# EAGLE design telem_board (EAGLE 6.5.0)
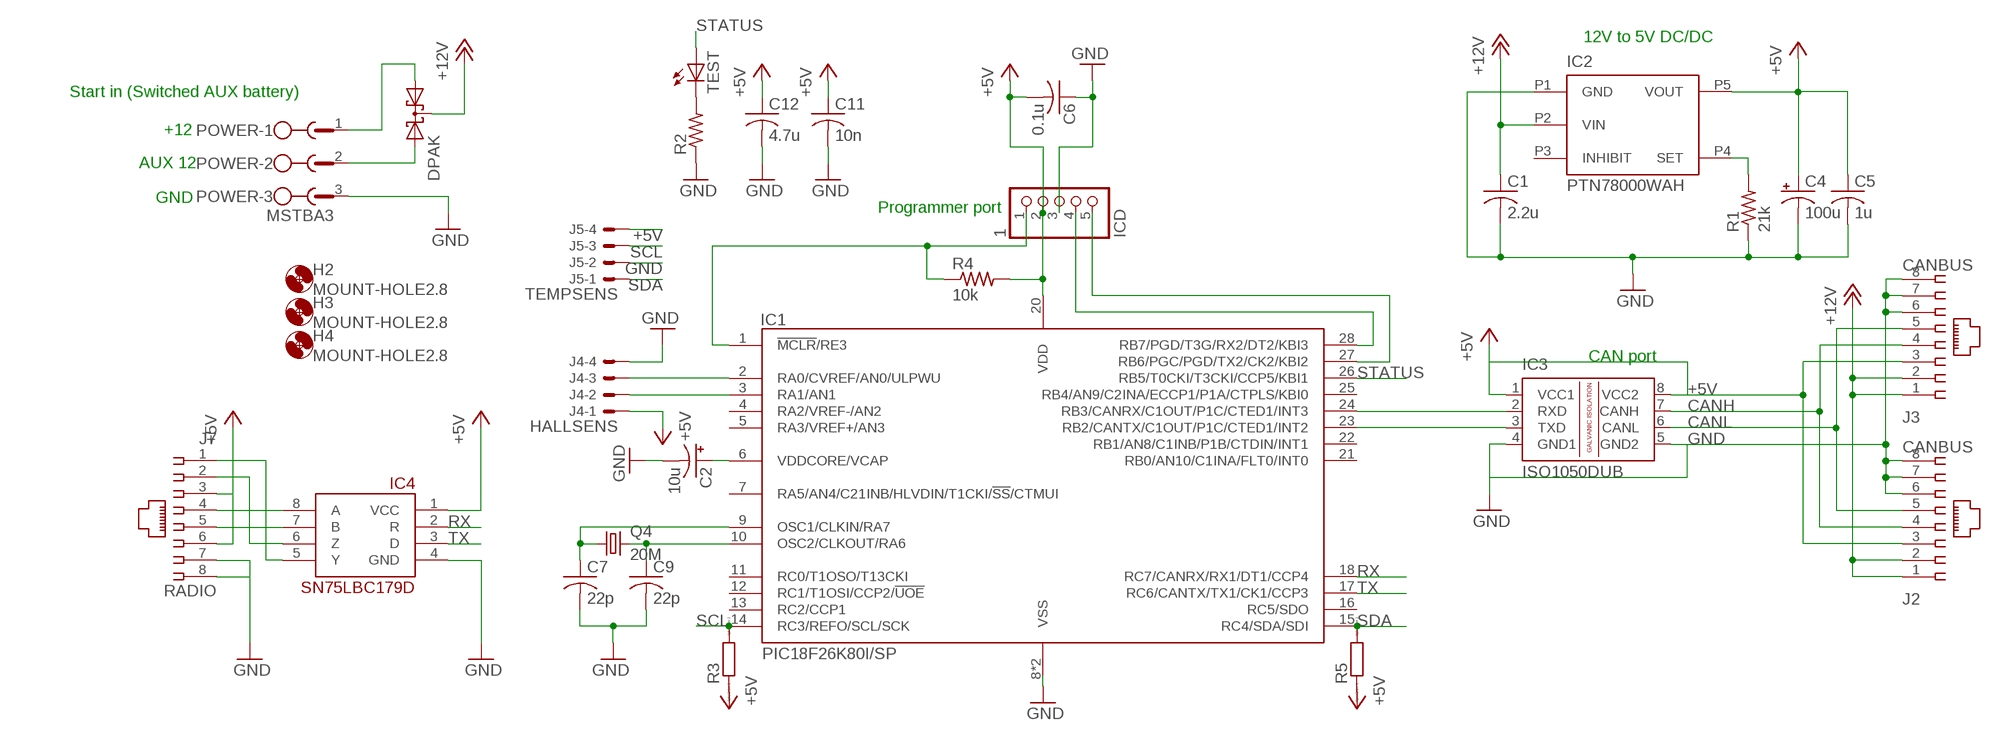
[diagram p0: schematic, sheet 1]

## Parts
1  ICD  PINHD-1X5  [1X05]
C1  2.2u  C-USC1206  [C1206]
C2  10u  CPOL-USTT2D4  [TT2D4]
C4  100u  CPOL-USSMCD  [SMC_D]
C5  1u  C-USC0805  [C0805]
C6  0.1u  C-USC0805  [C0805]
C7  22p  C-USC0805  [C0805]
C9  22p  C-USC0805  [C0805]
C11  10n  C-USC0805  [C0805]
C12  4.7u  C-USC0805  [C0805]
DPAK  DIODE_2SCHOTTKY-DPAK  [DPAK]
H2  MOUNT-HOLE2.8  [2,8]
H3  MOUNT-HOLE2.8  [2,8]
H4  MOUNT-HOLE2.8  [2,8]
IC1  PIC18F26K80I/SP  [DIL28/3]
IC2  PTN78000WAH  [PTN78000]
IC3  ISO1050DUB  [DUB-R-PDSO-G8]
IC4  SN75LBC179D  [SO08]
J2  CANBUS  215877-7  [215877-7]
J3  CANBUS  215877-7  [215877-7]
J4  HALLSENS  22-27-2041-04  [6410-04]
J5  TEMPSENS  22-27-2041-04  [6410-04]
J7  RADIO  215877-7  [215877-7]
POWER  MSTBA3  [MSTBA3]
Q4  20M  CRYSTALHC49S  [HC49/S]
R1  21k  R-US_R0805  [R0805]
R2  R-US_R0805  [R0805]
R3  R  [R0805]
R4  10k  R-US_R0805  [R0805]
R5  R  [R0805]
TEST  LEDCHIP-LED0805  [CHIP-LED0805]

## Nets
+5V: 1.2 C4.+ C5.1 C6.2 C11.1 C12.1 IC1.20(VDD) IC2.P5(VOUT) IC3.1(VCC1) IC3.8(VCC2) IC4.1(VCC) J2.3 J3.3 J4.1 J5.4 J7.3 J7.6 R3.1 R4.2 R5.1
+12V: C1.1 DPAK.3(C) IC2.P2(VIN) J2.1 J2.2 J3.1 J3.2
CANH: IC3.7(CANH) J2.4 J3.4
CANL: IC3.6(CANL) J2.5 J3.5
GND: 1.3 C1.2 C2.- C4.- C5.2 C6.1 C7.2 C9.2 C11.2 C12.2 IC1.8(VSS) IC1.19(VSS) IC2.P1(GND) IC3.4(GND1) IC3.5(GND2) IC4.4(GND) J2.6 J2.7 J2.8 J3.6 J3.7 J3.8 J4.4 J5.2 J7.7 J7.8 POWER.3 R1.1 R2.1
N$1: IC1.2(RA0/CVREF/AN0/ULPWU) J4.3
N$2: IC1.3(RA1/AN1) J4.2
N$3: IC4.7(B) J7.5
N$4: IC4.8(A) J7.4
N$5: C2.+ IC1.6(VDDCORE/VCAP)
N$6: IC1.23(RB2/CANTX/C1OUT/P1C/CTED1/INT2) IC3.3(TXD)
N$7: R2.2 TEST.C
N$8: IC2.P4(SET) R1.2
N$9: IC1.24(RB3/CANRX/C1OUT/P1C/CTED1/INT3) IC3.2(RXD)
N$10: IC4.6(Z) J7.2
N$12: IC4.5(Y) J7.1
N$13: DPAK.1(A1) POWER.1
N$14: DPAK.2(A2) POWER.2
N$15: 1.4 IC1.28(RB7/PGD/T3G/RX2/DT2/KBI3)
N$16: 1.5 IC1.27(RB6/PGC/PGD/TX2/CK2/KBI2)
N$20: 1.1 IC1.1(!MCLR!/RE3) R4.1
N$24: C7.1 IC1.9(OSC1/CLKIN/RA7) Q4.1
N$25: C9.1 IC1.10(OSC2/CLKOUT/RA6) Q4.2
RX: IC1.18(RC7/CANRX/RX1/DT1/CCP4) IC4.2(R)
SCL: IC1.14(RC3/REFO/SCL/SCK) J5.3 R3.2
SDA: IC1.15(RC4/SDA/SDI) J5.1 R5.2
STATUS: IC1.26(RB5/T0CKI/T3CKI/CCP5/KBI1) TEST.A
TX: IC1.17(RC6/CANTX/TX1/CK1/CCP3) IC4.3(D)
Unconnected: IC1.4(RA2/VREF-/AN2) IC1.5(RA3/VREF+/AN3) IC1.7(RA5/AN4/C21INB/HLVDIN/T1CKI/!SS!/CTMUI) IC1.11(RC0/T1OSO/T13CKI) IC1.12(RC1/T1OSI/CCP2/!UOE!) IC1.13(RC2/CCP1) IC1.16(RC5/SDO) IC1.21(RB0/AN10/C1INA/FLT0/INT0) IC1.22(RB1/AN8/C1INB/P1B/CTDIN/INT1) IC1.25(RB4/AN9/C2INA/ECCP1/P1A/CTPLS/KBI0) IC2.P3(INHIBIT)

## Notes on the sheet
- 12V to 5V DC/DC
- Start in (Switched AUX battery)
- +12
- AUX 12
- GND
- Programmer port
- CAN port

## Library data of the parts
1 = pinhead:PINHD-1X5: PIN HEADER
C1 C5-C7 C9 = rcl:C-US: CAPACITOR, American symbol
C2 C4 = rcl:CPOL-US: POLARIZED CAPACITOR, American symbol
C11 C12 = resistor:C-US: CAPACITOR, American symbol
DPAK = MSCP_2011_v2:DIODE_2SCHOTTKY-
H2-H4 = holes:MOUNT-HOLE: MOUNTING HOLE with drill center marker
IC1 = MSCP_2011_v2:PIC18F26K80
IC2 = MSCP_2011_v1:PTN78000WAH
IC3 = texas:ISO1050: ISOLATED CAN TRANSCEIVER Source: http://focus.ti.com/lit/ds/symlink/iso1050.pdf; MPN: ISO1050DUBR; OC_FARNELL: 1755712; OC_NEWARK: 14R9899
IC4 = MSCP_2011_v1:SN75LBC179
J2 J3 J7 = con-amp:215877-7: AMP connector
J4 J5 = con-molex:22-?-04: CONNECTOR wire to board 2.54 mm (.1 inch) pitch header; OC_FARNELL: unknown; OC_NEWARK: unknown
POWER = con-phoenix-508:MSTBA3: PHOENIX; MF: FARNELL; MPN: 1757255; OC_FARNELL: 3705183; OC_NEWARK: 71C4162
Q4 = crystal:CRYSTAL: CRYSTAL; OC_FARNELL: 1667008; OC_NEWARK: unknown
R1 R4 = rcl:R-US_: RESISTOR, American symbol
R2 = adafruit:R-US_: RESISTOR, American symbol
R3 R5 = eagle-ltspice:R: RESISTOR, European symbol; SPICEMODEL: NONE; SPICEPREFIX: R
TEST = led:LED: LED OSRAM: - CHIPLED LG R971, LG N971, LY N971, LG Q971, LY Q971, LO R971, LY R971 LH N974, LH R974 LS Q976, LO Q976, LY Q976 LO Q996 - Hyper CHIPLED LW Q18S LB Q993, LB Q99A, LB R99A - SideLED LS A670, LO A670, LY A670, LG A670, LP A670 LB A673, LV A673, LT A673, LW A673 LH A674 LY A675 LS A676, LA A676, LO A676, LY A676, LW A676 LS A679, LY A679, LG A679 - Hyper Micro SIDELED® LS Y876, LA Y876, LO Y876, LY Y876 LT Y87S - SmartLED LW L88C, LW L88S LB L89C, LB L89S, LG L890 LS L89K, LO L89K, LY L89K LS L896, LA L896, LO L896, LY L896 - TOPLED LS T670, LO T670, LY T670, LG T670, LP T670 LSG T670, LSP T670, LSY T670, LOP T670, LYG T670 LG T671, LOG T671, LSG T671 LB T673, LV T673, LT T673, LW T673 LH T674 LS T676, LA T676, LO T676, LY T676, LB T676, LH T676, LSB T676, LW T676 LB T67C, LV T67C, LT T67C, LS T67K, LO T67K, LY T67K, LW E67C LS E67B, LA E67B, LO E67B, LY E67B, LB E67C, LV E67C, LT E67C LW T67C LS T679, LY T679, LG T679 LS T770, LO T770, LY T770, LG T770, LP T770 LB T773, LV T773, LT T773, LW T773 LH T774 LS E675, LA E675, LY E675, LS T675 LS T776, LA T776, LO T776, LY T776, LB T776 LHGB T686 LT T68C, LB T68C - Hyper Mini TOPLED® LB M676 - Mini TOPLED Santana® LG M470 LS M47K, LO M47K, LY M47K Source: http://www.osram.convergy.de LUXEON: - LUMILED® LXK2-PW12-R00, LXK2-PW12-S00, LXK2-PW14-U00, LXK2-PW14-V00 LXK2-PM12-R00, LXK2-PM12-S00, LXK2-PM14-U00 LXK2-PE12-Q00, LXK2-PE12-R00, LXK2-PE12-S00, LXK2-PE14-T00, LXK2-PE14-U00 LXK2-PB12-K00, LXK2-PB12-L00, LXK2-PB12-M00, LXK2-PB14-N00, LXK2-PB14-P00, LXK2-PB14-Q00 LXK2-PR12-L00, LXK2-PR12-M00, LXK2-PR14-Q00, LXK2-PR14-R00 LXK2-PD12-Q00, LXK2-PD12-R00, LXK2-PD12-S00 LXK2-PH12-R00, LXK2-PH12-S00 LXK2-PL12-P00, LXK2-PL12-Q00, LXK2-PL12-R00 Source: www.luxeon.com KINGBRIGHT: KA-3528ASYC Source: www.kingbright.com

## Board
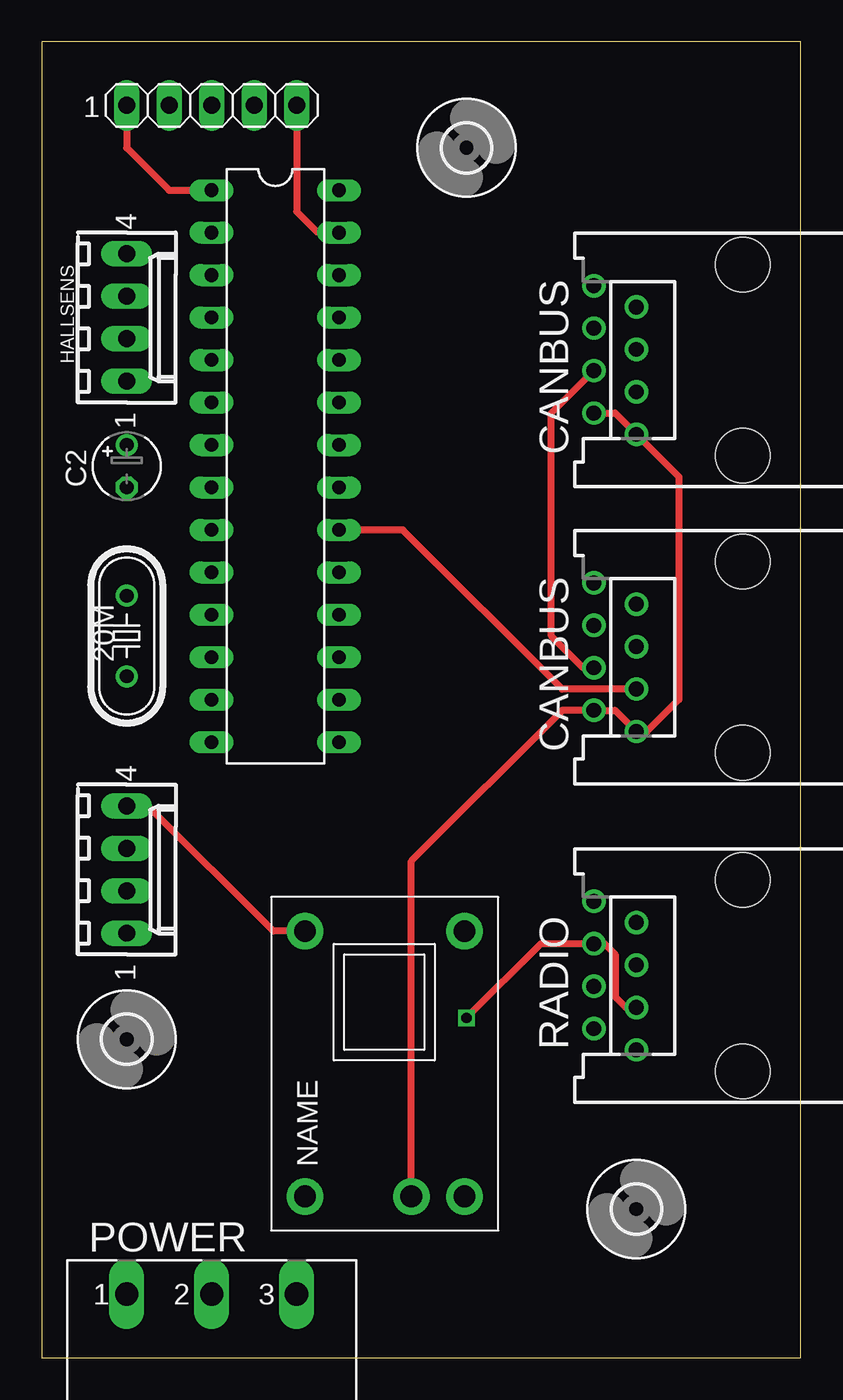
[diagram p1: board, top side]
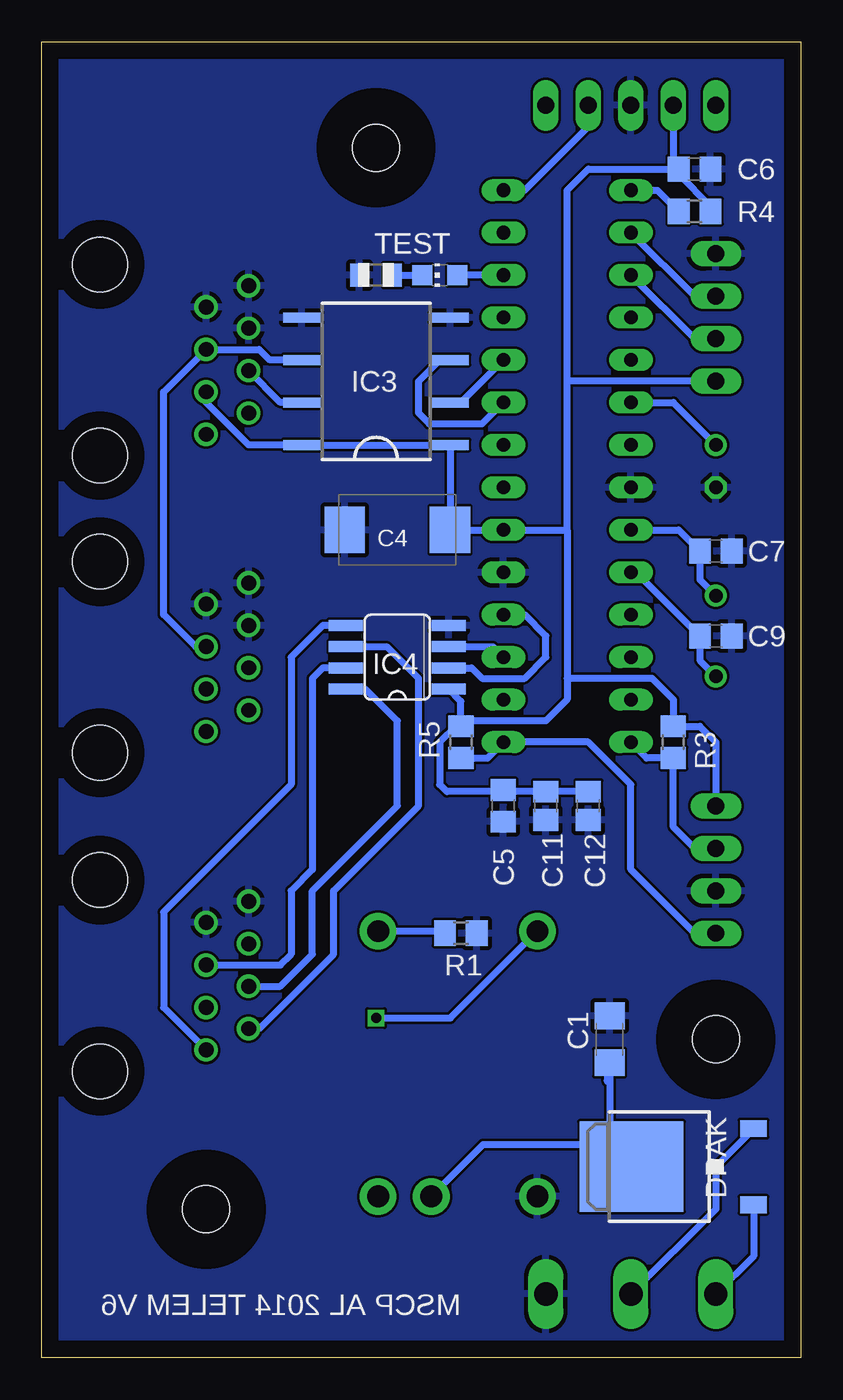
[diagram p2: board, bottom side, seen from below]

Size 45.39 x 78.73 mm. Coordinates in mm from the lower left corner, seen from the top.
Outline: 0,0 45.39,0 45.39,78.73 0,78.73 0,0
Copper layers (1*16): Top 0.035mm / dielectric 1.5mm / Bottom 0.035mm
Design rules "default *": minimum track width 10mil, minimum drill 24mil, track to track 6mil, track to pad 6mil, pad to pad 6mil, via to via 6mil, smd to smd 6mil, copper to edge 40mil, drill to drill 6mil, minimum pad ring 10mil, minimum via ring 8mil, stop-mask expansion 4mil, vias tented up to drill 0mil, thermal gap 10mil

### Footprints (pad centres in the part's own frame; a part is rotated, then mirrored left to right if it is on the bottom)
1X05 = drill 1.016 long: 1 -5.08,0; 2 -2.54,0; 3 0,0; 4 2.54,0; 5 5.08,0
C1206 = smd 1.6 x 1.8: 1 -1.4,0; 2 1.4,0
TT2D4 = drill 0.813: + -1.27,0 | drill 0.813 octagon: - 1.27,0
SMC_D = smd 2.4 x 2.8: + -3.15,0; - 3.15,0
C0805 = smd 1.3 x 1.5: 1 -0.95,0; 2 0.95,0
C0805' = smd 1.3 x 1.5: 1 -0.85,0; 2 0.85,0
DPAK = smd 1 x 1.6: 1 -2.28,-4.8; 2 2.28,-4.8 | smd 5.4 x 6.2: 3 0,2.5
2,8 = hole 2.8: 0,0
DIL28/3 = drill 0.813 long: 1 -16.51,-3.81; 2 -13.97,-3.81; 3 -11.43,-3.81; 4 -8.89,-3.81; 5 -6.35,-3.81; 6 -3.81,-3.81; 7 -1.27,-3.81; 8 1.27,-3.81; 9 3.81,-3.81; 10 6.35,-3.81; 11 8.89,-3.81; 12 11.43,-3.81; 13 13.97,-3.81; 14 16.51,-3.81; 15 16.51,3.81; 16 13.97,3.81; 17 11.43,3.81; 18 8.89,3.81; 19 6.35,3.81; 20 3.81,3.81; 21 1.27,3.81; 22 -1.27,3.81; 23 -3.81,3.81; 24 -6.35,3.81; 25 -8.89,3.81; 26 -11.43,3.81; 27 -13.97,3.81; 28 -16.51,3.81
PTN78000 = drill 1.3 pad 2.184: P1 -8.128,4.572; P2 -8.128,-1.778; P3 -8.128,-4.953; P4 7.747,-4.953; P5 7.747,4.572
DUB-R-PDSO-G8 = smd 0.6 x 2.2: 1 -3.81,-4.445; 2 -1.27,-4.445; 3 1.27,-4.445; 4 3.81,-4.445; 5 3.81,4.445; 6 1.27,4.445; 7 -1.27,4.445; 8 -3.81,4.445
SO08 = smd 0.66 x 2.032: 1 -1.905,-3.073; 2 -0.635,-3.073; 3 0.635,-3.073; 4 1.905,-3.073; 5 1.905,3.073; 6 0.635,3.073; 7 -0.635,3.073; 8 -1.905,3.073
215877-7 = drill 0.889: 1 -4.445,6.35; 2 -3.175,8.89; 3 -1.905,6.35; 4 -0.635,8.89; 5 0.635,6.35; 6 1.905,8.89; 7 3.175,6.35; 8 4.445,8.89 | hole 3.251: -5.715,0; 5.715,0
6410-04 = drill 1.016 long: 1 3.81,0; 2 1.27,0; 3 -1.27,0; 4 -3.81,0
MSTBA3 = drill 1.397 long: 1 -5.08,5.08; 2 0,5.08; 3 5.08,5.08
HC49/S = drill 0.813: 1 -2.413,0; 2 2.413,0
R0805 = smd 1.3 x 1.5: 1 -0.95,0; 2 0.95,0
R0805' = smd 1.1 x 1.4: 1 -1,0; 2 1,0
CHIP-LED0805 = smd 1.2 x 1.2: A 0,-1.05; C 0,1.05

### Placement (x,y rotation side)
1  10.16,74.93 0 top
C1  11.43,19.05 90 bottom
C2  5.08,53.34 270 top
C4  24.13,49.53 180 bottom
C5  17.78,33.02 270 bottom
C6  6.35,71.12 180 bottom
C7  5.08,48.26 0 bottom
C9  5.08,43.18 0 bottom
C11  10n  [C0805']  15.24,33.02 270 bottom
C12  4.7u  [C0805']  12.7,33.02 270 bottom
DPAK  7.62,11.43 90 bottom
H2  5.08,19.05 0 top
H3  25.4,72.39 0 top
H4  35.56,8.89 0 top
IC1  13.97,53.34 270 top
IC2  20.32,17.78 90 top
IC3  25.4,58.42 90 bottom
IC4  24.13,41.91 90 bottom
J2  41.91,59.69 90 top
J3  41.91,41.91 90 top
J4  5.08,62.23 270 top
J5  5.08,29.21 270 top
J7  41.91,22.86 90 top
POWER  10.16,-1.27 0 top
Q4  5.08,43.18 270 top
R1  20.32,25.4 180 bottom
R2  [R0805']  25.4,64.77 0 bottom
R3  7.62,36.83 270 bottom
R4  6.35,68.58 0 bottom
R5  20.32,36.83 270 bottom
TEST  21.59,64.77 90 bottom

### Tracks (layer width: path | path; a pad name or v marks a point on that pad's centre or on a via)
+5V  (via drill 0.6)
  Top 0.406: IC2.P5 13.84,25.53 6.35,33.02 J5.4 | J3.3 31.11,40.01 21.59,49.53 IC1.20 | v25.4,20.32 29.84,24.77 J7.6 33.66,24.77 34.29,24.13 34.29,21.59 34.92,20.95 J7.3
  Bottom 0.406: 13.97,49.53 IC1.20 C4.+ 20.95,49.55 IC3.1 IC3.8 33.02,54.61 35.56,57.15 J2.3 | 13.97,49.53 13.97,58.42 | 13.97,58.42 13.97,69.85 12.7,71.12 7.62,71.12 | J4.1 13.97,58.42 | 13.97,40.64 8.89,40.64 7.62,39.37 R3.1 6.03,37.78 5.08,36.83 J5.4 | 13.97,49.53 13.97,40.64 | 13.97,40.64 13.97,39.37 15.24,38.1 20,38.1 R5.1 | R5.1 20.32,39.27 IC4.1 | C12.1 C11.1 | C11.1 17.68,33.87 C5.1 | C11.1 21.17,33.87 21.59,34.29 21.59,36.83 20.64,37.78 R5.1 | 7.62,71.12 C6.2 7.3,70.8 5.4,68.9 R4.2 | 1.2 7.62,71.12 | v25.4,20.32 20.95,20.32 IC2.P5
+12V
  Top 0.406: IC2.P2 22.1,29.72 31.11,38.73 J3.2 34.29,38.73 J3.1 36.2,37.47 38.1,39.37 38.1,52.7 J2.1 34.29,56.52 J2.2
  Bottom 0.406: 11.56,16.51 C1.1 11.43,12.74 | 11.43,12.74 DPAK.3 | 11.43,12.74 19.01,12.74 IC2.P2
CANH
  Top 0.406: J3.4 32.38,41.27 30.48,43.18 30.48,56.52 J2.4
  Bottom 0.406: IC3.7 31.11,57.15 J2.4
CANL
  Bottom 0.406: J3.5 36.2,42.55 38.1,44.45 38.1,57.78 J2.5 32.38,60.33 31.75,59.69 IC3.6
GND
  pour Bottom: -1.27,-1.27 45.72,-1.27 45.72,78.74 -1.27,78.74
N$1
  Bottom 0.406: J4.3 6.35,63.5 IC1.2
N$2
  Bottom 0.406: J4.2 6.35,60.96 IC1.3
N$3
  Bottom 0.406: J7.5 31.11,23.5 30.48,24.13 30.48,27.94 29.21,29.21 29.21,40.64 28.57,41.27 IC4.7
N$4
  Bottom 0.406: J7.4 31.11,22.23 29.21,24.13 29.21,27.94 24.13,33.02 24.13,38.1 26.04,40.01 IC4.8
N$5
  Bottom 0.406: IC1.6 7.62,57.15 C2.+
N$6
  Bottom 0.406: IC3.3 21.59,59.69 22.86,58.42 22.86,56.52 22.23,55.88 19.05,55.88 IC1.23
N$7
  Bottom 0.406: R2.2 TEST.C
N$8
  Bottom 0.406: IC2.P4 21.4,25.53 R1.2
N$9
  Bottom 0.406: IC3.2 20.32,57.15 IC1.24
N$10
  Bottom 0.406: J7.2 32.38,19.68 27.94,24.13 27.94,27.94 22.86,33.02 22.86,40.64 24.77,42.55 IC4.6
N$12
  Bottom 0.406: J7.1 38.1,20.95 38.1,26.67 30.48,34.29 30.48,41.91 28.57,43.81 IC4.5
N$13
  Bottom 0.406: DPAK.1 2.82,6.07 POWER.1
N$14
  Bottom 0.406: POWER.2 5.08,8.89 5.08,11.43 2.82,13.69 DPAK.2
N$15
  Bottom 0.406: 1.4 12.7,73.66 16.51,69.85 IC1.28
N$16
  Top 0.406: 1.5 15.24,68.58 16.51,67.31 IC1.27
N$20
  Top 0.406: 1.1 5.08,72.39 7.62,69.85 IC1.1
  Bottom 0.406: IC1.1 8.57,69.85 R4.1
N$24
  Bottom 0.406: IC1.9 7.3,49.53 C7.1 6.03,46.54 Q4.1
N$25
  Bottom 0.406: Q4.2 6.03,41.72 C9.1 9.84,46.99 IC1.10
RX
  Bottom 0.406: IC4.2 19.68,41.27 19.05,40.64 16.51,40.64 15.24,41.91 15.24,43.18 16.51,44.45 IC1.18
SCL
  Bottom 0.406: J5.3 6.35,30.48 7.62,31.75 R3.2 9.21,35.88 IC1.14
SDA
  Bottom 0.406: J5.1 6.35,25.4 10.16,29.21 10.16,34.29 12.7,36.83 IC1.15 18.73,35.88 R5.2
STATUS
  Bottom 0.406: IC1.26 TEST.A
TX
  Bottom 0.406: IC4.3 18.41,42.55 IC1.17

### Text on the board
bPlace: MSCP AL 2014 TELEM V6